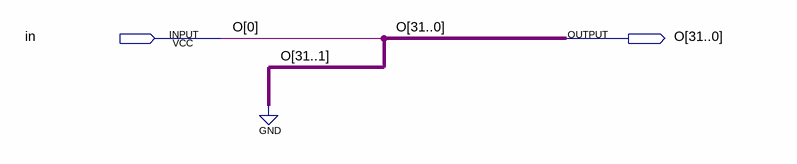
[diagram p0: schematic sheet]
// Quartus schematic zeroextender.bdf as structural Verilog: 0 symbols, 2 pins
module zeroextender (
  input  in,
  output [31:0] O
);


  assign O = {{31{1'b0}}, in};
endmodule
